# Altium project V3S_CDR_STD_V1_0_20150526.PrjPcb (part 2 of 2)
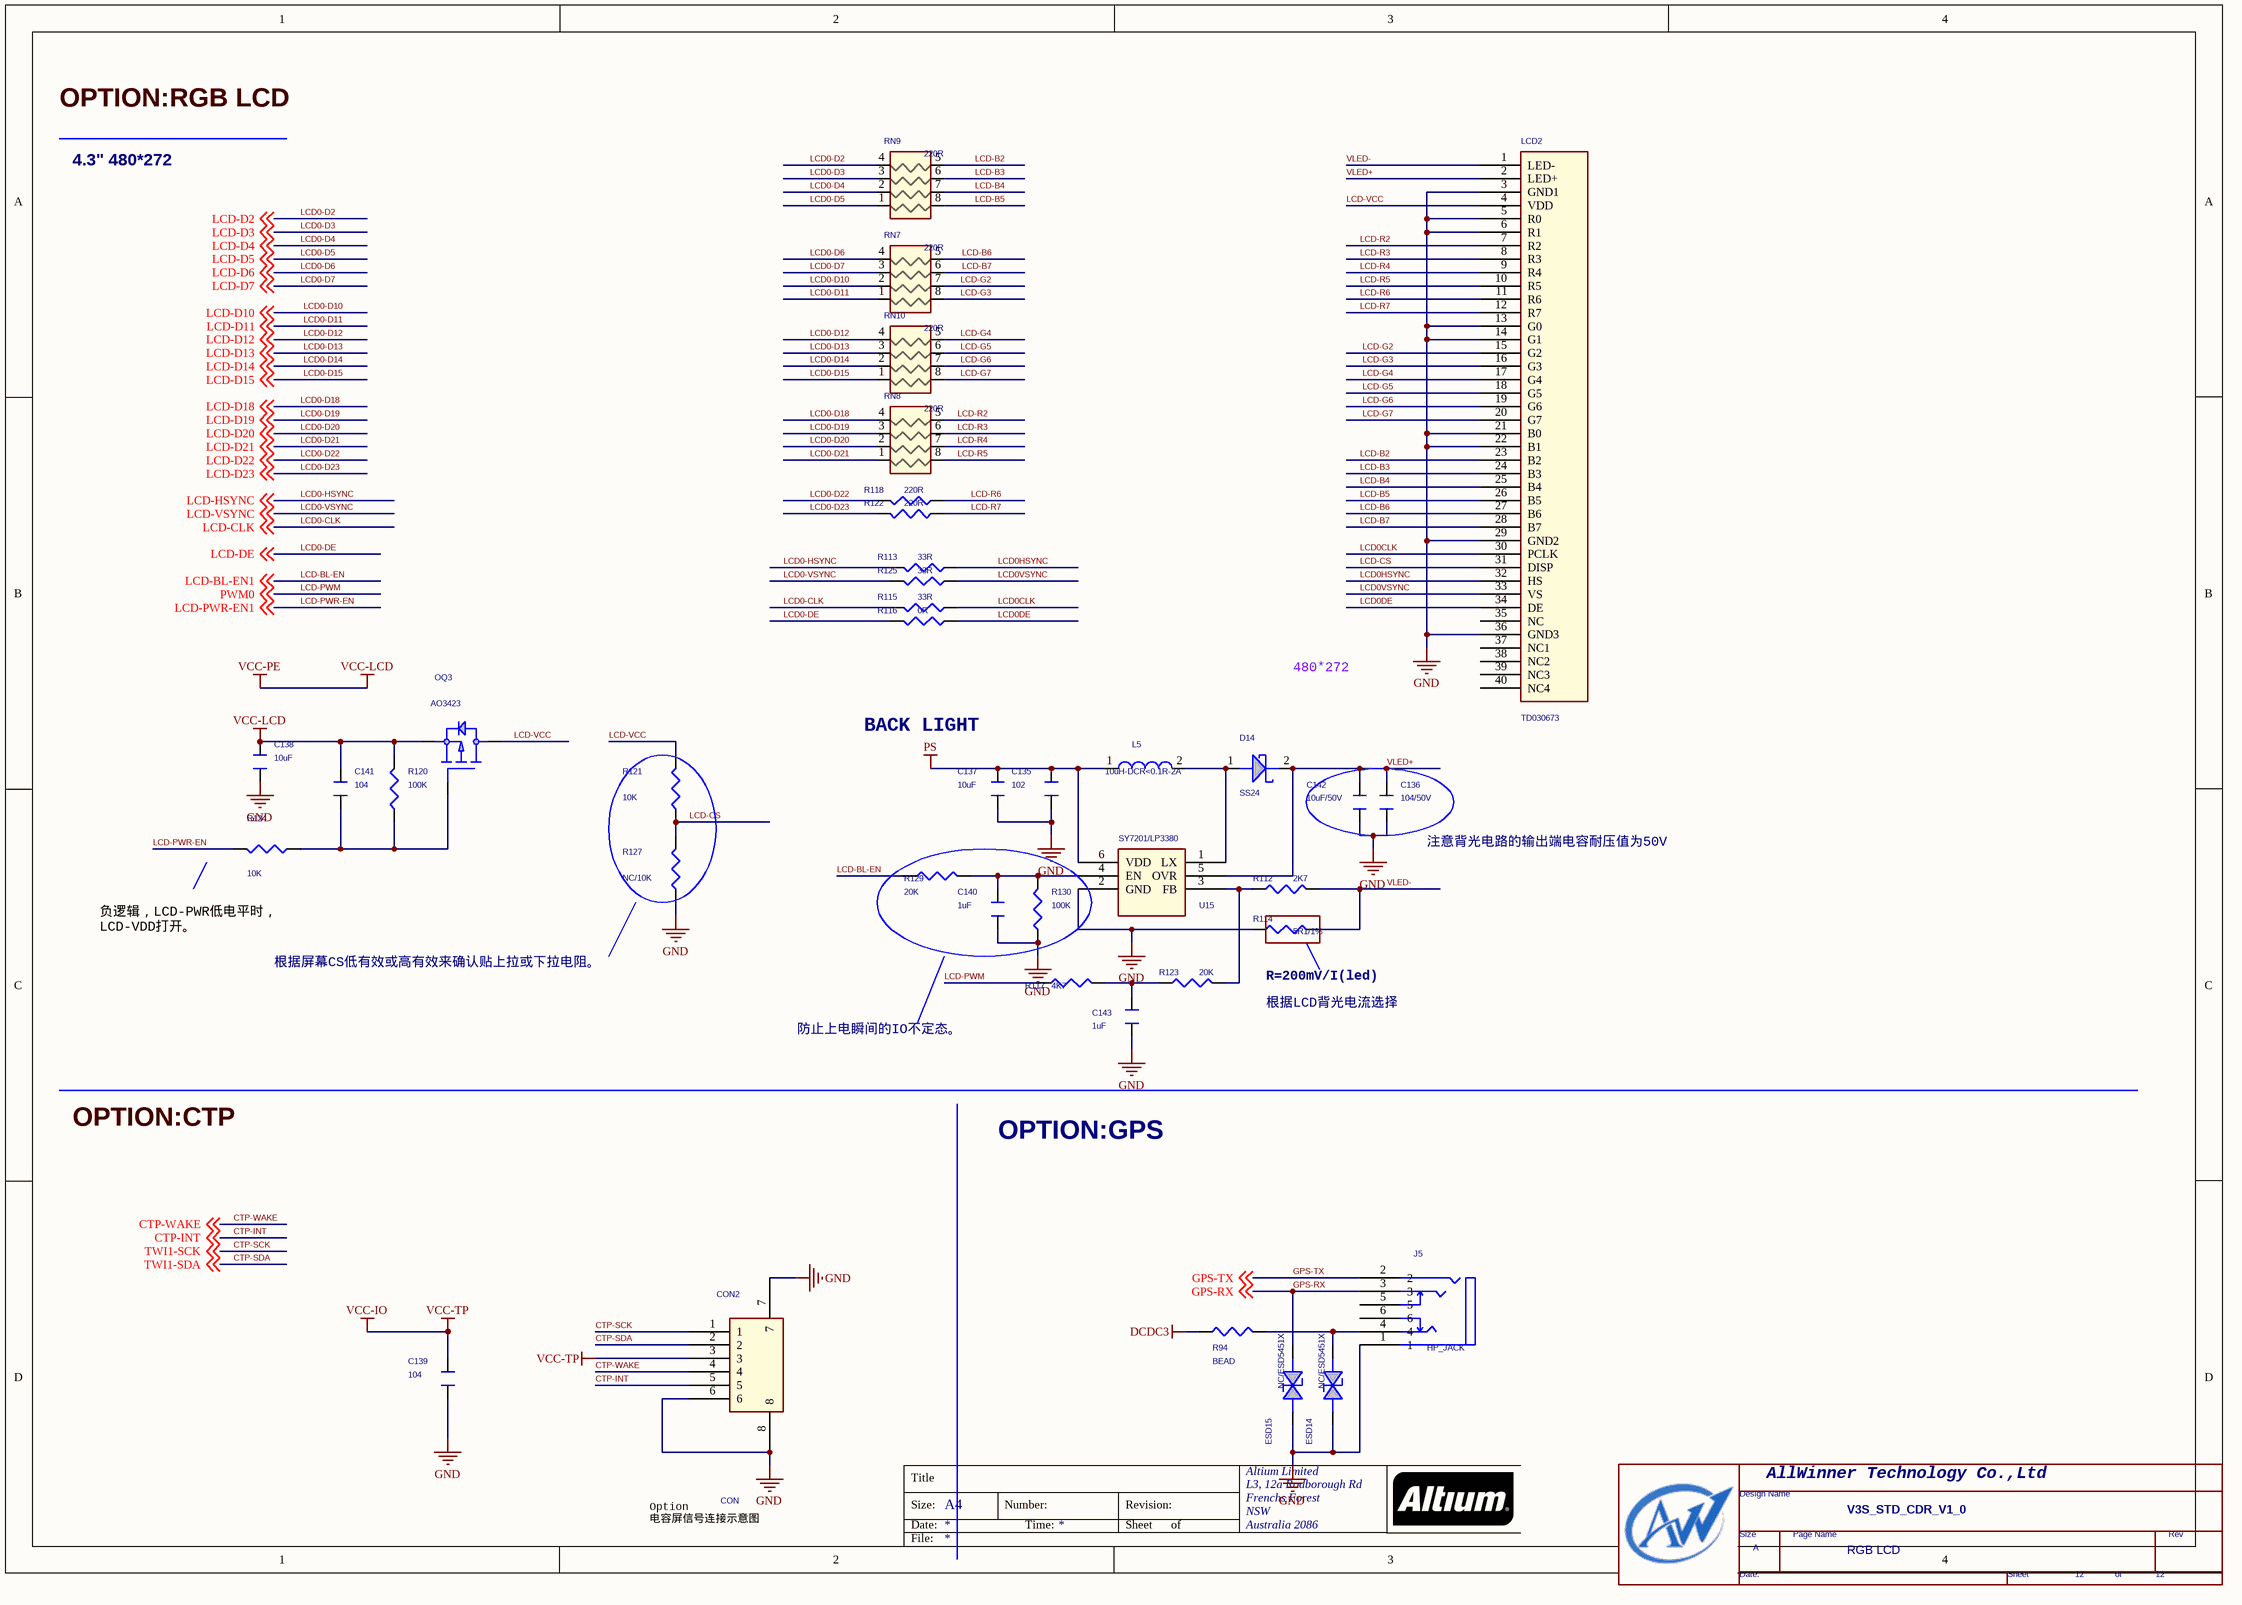
[diagram p12: 12 RGB LCD.SchDoc]

## Nets that join several sheets
AVCC: 05 CPU (5 pins), 06 POWER (C63.1 R8.1 U2.12), 10 Speaker_Microphone (C208.2 R92.1), 11 USB_KEY_GSENSOR (R87.1)
DCDC2: 05 CPU (23 pins), 06 POWER (C53.1 L3.2 U2.10)
DCDC3: 05 CPU (15 pins), 06 POWER (12 pins), 07 CAMERA-MIPI (C110.1 R28.2 U11.1), 09 NOR NANDFlash_TF Car (7 pins), 11 USB_KEY_GSENSOR (R57.2 R60.2 R72.2), 12 RGB LCD (C139.2 CON2.3 R94.1)
GND: 05 CPU (40 pins), 06 POWER (46 pins), 07 CAMERA-MIPI (18 pins), 08 Serial RGB LCD (20 pins), 09 NOR NANDFlash_TF Car (13 pins), 10 Speaker_Microphone (26 pins), 11 USB_KEY_GSENSOR (32 pins), 12 RGB LCD (27 pins)
LDO1: 05 CPU (C157.2 U1.98), 06 POWER (C61.2 R27.2 U2.28), 11 USB_KEY_GSENSOR (C1.1 C225.1 U17.3 U17.9)
LDO3: 06 POWER (C65.2 U2.41), 07 CAMERA-MIPI (C164.1 C170.2 CONN2.10)
LDO4: 06 POWER (C99.2 U2.11), 07 CAMERA-MIPI (C173.1 C174.2 CONN2.8)
MIPI-IOVCC: 05 CPU (U1.12 U1.29), 07 CAMERA-MIPI (8 pins), 08 Serial RGB LCD (C93.2 C94.2 OQ1.2 R52.2), 12 RGB LCD (C138.2 C141.2 OQ3.2 R120.2)
PS: 06 POWER (18 pins), 08 Serial RGB LCD (C97.2 C98.2 L6.1 U6.6), 10 Speaker_Microphone (FB1.2 FB3.2), 11 USB_KEY_GSENSOR (C106.2 U10.5), 12 RGB LCD (C135.2 C137.2 L5.1 U15.6)
RESET: 05 CPU (C175.2 U1.99), 06 POWER (R27.1 U2.25)
USBVBUS: 06 POWER (C57.1 U2.31), 11 USB_KEY_GSENSOR (6 pins)
VCC-DRAM: 05 CPU (18 pins), 06 POWER (5 pins)
CSI-SCK: 05 CPU (U1.9), 07 CAMERA-MIPI (CONN2.5 R47.2)
CSI-SDA: 05 CPU (U1.8), 07 CAMERA-MIPI (CONN2.6 R46.2)
CTP-INT: 05 CPU (R15.1 U1.40), 12 RGB LCD (CON2.5 ESD15.1 J5.3)
CTP-SCK: 05 CPU (U1.48), 11 USB_KEY_GSENSOR (R60.1 U17.6), 12 RGB LCD (CON2.1)
CTP-SDA: 05 CPU (U1.49), 11 USB_KEY_GSENSOR (R57.1 U17.7), 12 RGB LCD (CON2.2)
CTP-WAKE: 05 CPU (TP1.1 U1.39), 12 RGB LCD (CON2.4 J5.2)
HBIAS: 05 CPU (U1.119), 10 Speaker_Microphone (C178.2 R128.2)
HPCOM: 05 CPU (U1.125), 10 Speaker_Microphone (C168.2 ESD11.1 J2.2 R99.1)
HPCOMBP: 05 CPU (U1.124), 10 Speaker_Microphone (R99.2)
HPL: 05 CPU (U1.121), 10 Speaker_Microphone (C103.2 C104.2 C182.1 R100.1)
HPOUTR: 05 CPU (U1.120), 10 Speaker_Microphone (C105.2 C128.2 C171.1 R59.1)
KEYADC0: 05 CPU (C160.2 U1.112), 11 USB_KEY_GSENSOR (ESD1.1 R87.2 R88.1)
LCD-BL-EN: 05 CPU (U1.18 U1.41), 08 Serial RGB LCD (R56.2 U6.4), 12 RGB LCD (R129.1 RN10.3)
LCD-CLK: 05 CPU (U1.37), 08 Serial RGB LCD (R50.2), 12 RGB LCD (R115.2)
LCD-CS: 05 CPU (U1.16), 08 Serial RGB LCD (C92.2 LCD1.39 R51.2), 12 RGB LCD (LCD2.31 R121.2 R127.1 RN10.1)
LCD-D2: 05 CPU (U1.33), 12 RGB LCD (RN9.4)
LCD-D3: 05 CPU (U1.32), 08 Serial RGB LCD (RN2.4), 12 RGB LCD (RN9.3)
LCD-D4: 05 CPU (U1.31), 08 Serial RGB LCD (RN2.3), 12 RGB LCD (RN9.2)
LCD-D5: 05 CPU (U1.30), 08 Serial RGB LCD (RN2.2), 12 RGB LCD (RN9.1)
LCD-D6: 05 CPU (U1.28), 08 Serial RGB LCD (RN2.1), 12 RGB LCD (RN7.4)
LCD-D7: 05 CPU (U1.27), 08 Serial RGB LCD (RN1.4), 12 RGB LCD (RN7.3)
LCD-D10: 05 CPU (U1.24), 08 Serial RGB LCD (RN1.3), 12 RGB LCD (RN7.2)
LCD-D11: 05 CPU (U1.23), 08 Serial RGB LCD (RN1.2), 12 RGB LCD (RN7.1)
LCD-D12: 05 CPU (U1.22), 08 Serial RGB LCD (RN1.1), 12 RGB LCD (RN10.4)
LCD-D14: 05 CPU (U1.17 U1.42), 08 Serial RGB LCD (R53.2), 12 RGB LCD (R124.2 RN10.2)
LCD-D18: 05 CPU (U1.15), 08 Serial RGB LCD (LCD1.37), 12 RGB LCD (RN8.4)
LCD-D19: 05 CPU (U1.14), 08 Serial RGB LCD (LCD1.38), 12 RGB LCD (RN8.3)
LCD-D20: 05 CPU (U1.13), 12 RGB LCD (RN8.2)
LCD-D21: 05 CPU (U1.11), 12 RGB LCD (RN8.1)
LCD-D22: 05 CPU (U1.7), 12 RGB LCD (R118.2)
LCD-D23: 05 CPU (U1.6), 12 RGB LCD (R122.2)
LCD-DE: 05 CPU (U1.36), 12 RGB LCD (R116.2)
LCD-HSYNC: 05 CPU (U1.35), 08 Serial RGB LCD (R49.2), 12 RGB LCD (R113.2)
LCD-PWM: 05 CPU (U1.43), 12 RGB LCD (R117.1)
LCD-VSYNC: 05 CPU (U1.34), 08 Serial RGB LCD (R48.2), 12 RGB LCD (R125.2)
MIC1N: 05 CPU (U1.114), 10 Speaker_Microphone (C213.1)
MIC1P: 05 CPU (U1.113), 10 Speaker_Microphone (C211.1)
MIPI-CSI-CLKN: 05 CPU (U1.87), 07 CAMERA-MIPI (CONN2.20)
MIPI-CSI-CLKP: 05 CPU (U1.86), 07 CAMERA-MIPI (CONN2.19)
MIPI-CSI-D0N: 05 CPU (U1.82), 07 CAMERA-MIPI (CONN2.14)
MIPI-CSI-D0P: 05 CPU (U1.81), 07 CAMERA-MIPI (CONN2.13)
MIPI-CSI-D1N: 05 CPU (U1.84), 07 CAMERA-MIPI (CONN2.17)
MIPI-CSI-D1P: 05 CPU (U1.83), 07 CAMERA-MIPI (CONN2.16)
MIPI-CSI-MCLK: 05 CPU (U1.10), 07 CAMERA-MIPI (R45.2)
MIPI-CSI-PWDN: 05 CPU (U1.4), 07 CAMERA-MIPI (CONN2.2 R105.1)
MIPI-CSI-RESET: 05 CPU (U1.5), 07 CAMERA-MIPI (CONN2.1 R104.1)
PA-SHDN-N: 05 CPU (U1.44), 10 Speaker_Microphone (R71.2 R109.1 U9.C2 U14.1)
PMU-IRQ: 05 CPU (U1.128), 06 POWER (D1.1 R24.1)
PWRON-209: 06 POWER (K6.1 R19.2), 11 USB_KEY_GSENSOR (U17.5)
SDC0-CLK: 05 CPU (R126.2), 09 NOR NANDFlash_TF Car (ESD23.1 SU1.5)
SDC0-CMD: 05 CPU (U1.103), 09 NOR NANDFlash_TF Car (ESD22.1 R66.1 SU1.3)
SDC0-D0: 05 CPU (U1.106), 09 NOR NANDFlash_TF Car (ESD24.1 SU1.7)
SDC0-D1: 05 CPU (U1.107), 09 NOR NANDFlash_TF Car (ESD25.1 SU1.8)
SDC0-D2: 05 CPU (U1.101), 09 NOR NANDFlash_TF Car (ESD20.1 SU1.1)
SDC0-D3: 05 CPU (U1.102), 09 NOR NANDFlash_TF Car (ESD21.1 SU1.2)
SPI-CLK: 05 CPU (U1.53), 09 NOR NANDFlash_TF Car (U7.6)
SPI-CS: 05 CPU (U1.54), 09 NOR NANDFlash_TF Car (R63.2 U7.1)
SPI-MISO: 05 CPU (U1.52), 09 NOR NANDFlash_TF Car (U7.2), 11 USB_KEY_GSENSOR (K5.1)
SPI-MOSI: 05 CPU (U1.55), 09 NOR NANDFlash_TF Car (U7.5)
TWI-SCK: 05 CPU (U1.45), 06 POWER (R25.1 U2.2)
TWI-SDA: 05 CPU (U1.46), 06 POWER (R26.1 U2.1)
USB-DM: 05 CPU (U1.110), 11 USB_KEY_GSENSOR (ESD7.1 P1.2)
USB-DP: 05 CPU (U1.111), 11 USB_KEY_GSENSOR (ESD6.1 P1.3)
USB-DRVVBUS: 05 CPU (U1.2), 06 POWER (U2.6), 11 USB_KEY_GSENSOR (R73.2 R175.2 U5.4 U10.4)
USB-ID: 05 CPU (U1.100), 11 USB_KEY_GSENSOR (R75.2)
VLED+: 08 Serial RGB LCD (5 pins), 12 RGB LCD (5 pins)
VLED-: 08 Serial RGB LCD (LCD1.2 R58.1 U6.3), 12 RGB LCD (LCD2.1 R112.2 R114.1)